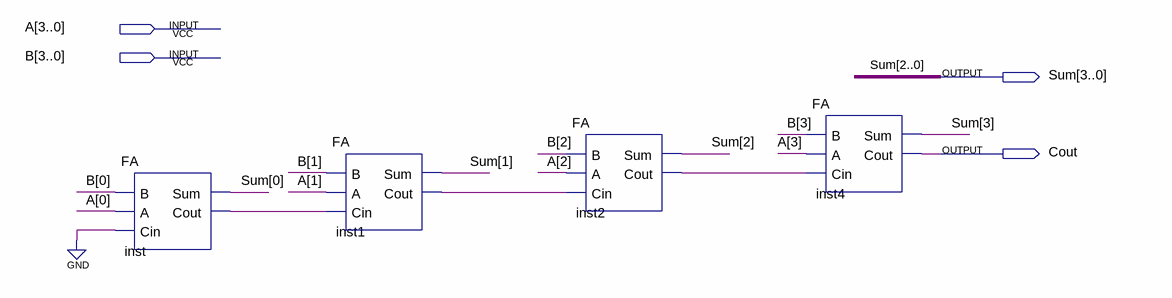
[diagram p0: schematic sheet]
// Quartus schematic adder_4_bit.bdf as structural Verilog: 4 symbols, 4 pins
module adder_4_bit (
  input  [3:0] A,
  input  [3:0] B,
  output [3:0] Sum,
  output Cout
);

  wire inst1_cout, inst2_cout, inst_cout;

  FA inst (.B(B[0]), .A(A[0]), .Cin(1'b0), .Sum(Sum[0]), .Cout(inst_cout));
  FA inst1 (.B(B[1]), .A(A[1]), .Cin(inst_cout), .Sum(Sum[1]), .Cout(inst1_cout));
  FA inst2 (.B(B[2]), .A(A[2]), .Cin(inst1_cout), .Sum(Sum[2]), .Cout(inst2_cout));
  FA inst4 (.B(B[3]), .A(A[3]), .Cin(inst2_cout), .Sum(Sum[3]), .Cout(Cout));
endmodule
